# Altium schematic sheet Microcontroller and Power Management.SchDoc
size A4; SheetNumber: 1; SheetTotal: 4
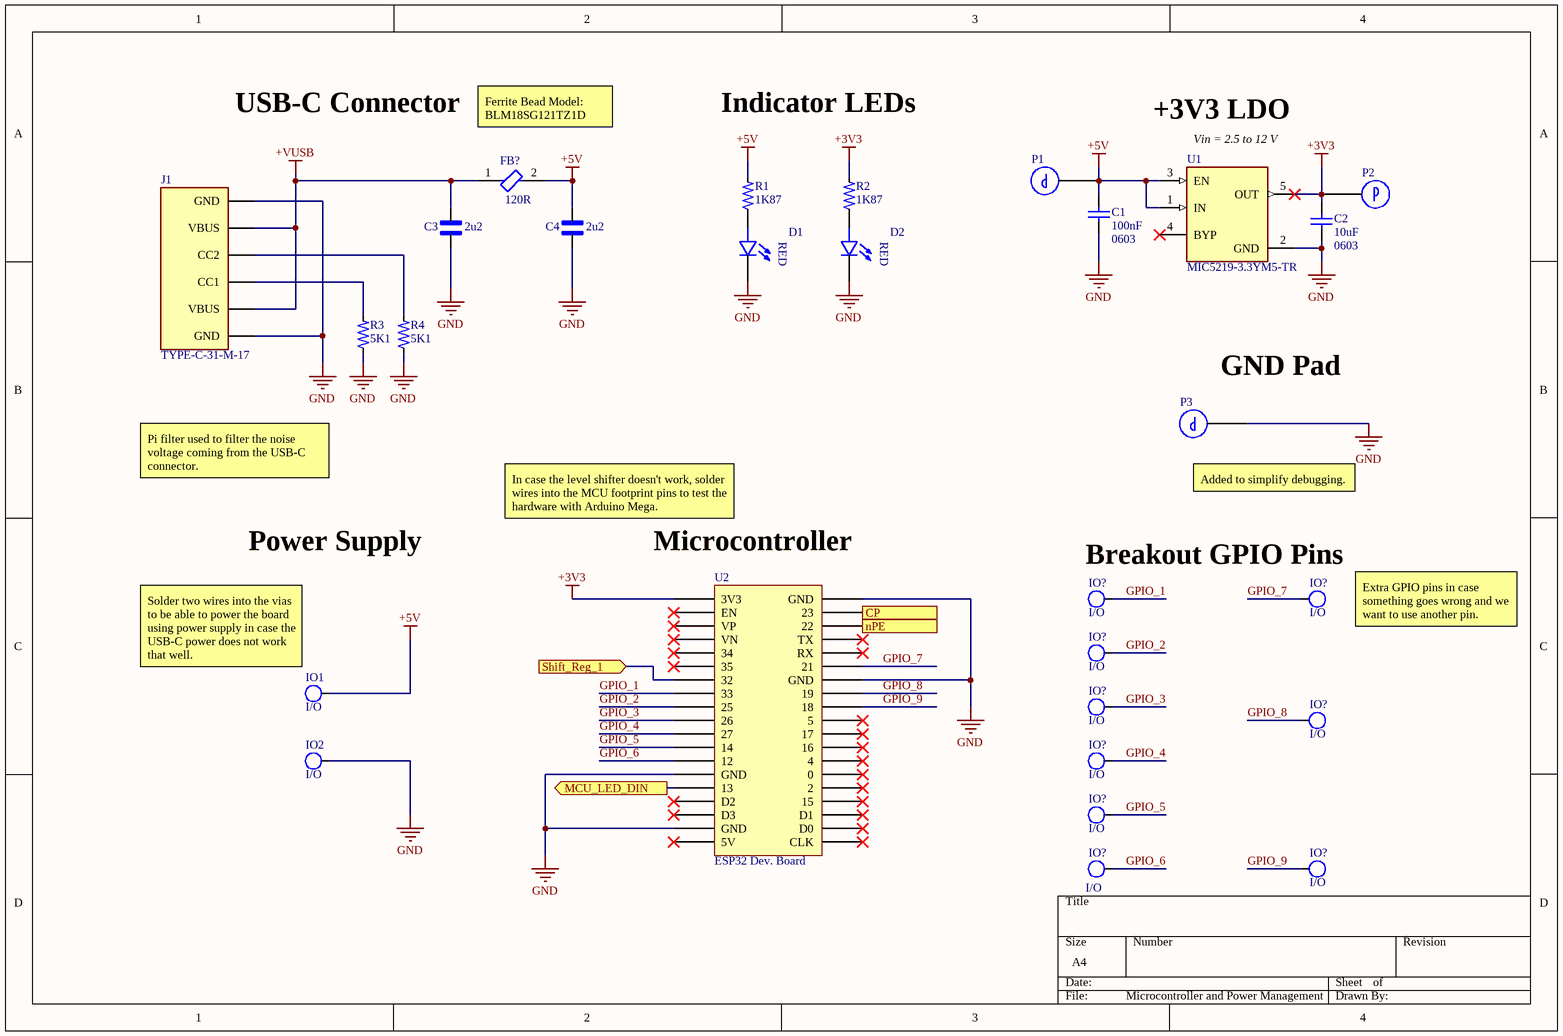
[diagram p0: Microcontroller and Power Management.SchDoc]

## Parts
(Parts that share a designator on the sheet are numbered #1, #2 ... from top to bottom, then left to right.)
C1  100nF  value 0603  [CAP 0805]
C2  10uF  value 0603  [CAP 0805]
C3  2u2  [CAP 0805]
C4  2u2  [CAP 0805]
D1  LED 0805  [LED_0805]  (value not drawn)
D2  LED 0805  [LED_0805]  (value not drawn)
FB?  120R  [FP-BLM21-0_2-t0_85-e0_5-IPC_A]
IO1  I/O  [I/O]
IO2  I/O  [I/O]
IO?#1  I/O
IO?#2  I/O
IO?#3  I/O
IO?#4  I/O
IO?#5  I/O
IO?#6  I/O
IO?#7  I/O
IO?#8  I/O
IO?#9  I/O
J1  TYPE-C-31-M-17  [TYPEC31M17]
P1  Probe_5019  [Testpoint]  (value not drawn)
P2  Probe_5019  [Testpoint]  (value not drawn)
P3  Probe_5019  [Testpoint]  (value not drawn)
R1  1K87  [res 0805]
R2  1K87  [res 0805]
R3  5K1  [res 0805]
R4  5K1  [res 0805]
U1  MIC5219-3.3YM5-TR  [FP-SOT23-5LD-PL-1-IPC_C]
U2  ESP32 Dev. Board

## Ports
CP (out, see Shift Registers[1A]), MCU_LED_DIN (out, see WS2818B[1B]), nPE (out, see Shift Registers[1B]), Shift_Reg_1 (in, see Shift Registers[3B])

## Nets
+3V3: C2.2 P2.1 R2.2 U1.5(OUT) U2.1(3V3)
+5V: C1.2 C4.2 FB?.2 IO1.1 P1.1 R1.2 U1.1(IN) U1.3(EN)
+VUSB: C3.2 FB?.1 J1.2(VBUS) J1.5(VBUS)
GND: C1.1 C2.1 C3.1 C4.1 D1.1(C) D2.1(C) IO2.1 J1.1(GND) J1.6(GND) P3.1 R3.1 R4.1 U1.2(GND) U2.14(GND) U2.18(GND) U2.32(GND) U2.38(GND)
CP: U2.37(23) ; port CP
GPIO_1: IO?#1.1 U2.8(33)
GPIO_2: IO?#3.1 U2.9(25)
GPIO_3: IO?#4.1 U2.10(26)
GPIO_4: IO?#6.1 U2.11(27)
GPIO_5: IO?#7.1 U2.12(14)
GPIO_6: IO?#8.1 U2.13(12)
GPIO_7: IO?#2.1 U2.33(21)
GPIO_8: IO?#5.1 U2.31(19)
GPIO_9: IO?#9.1 U2.30(18)
MCU_LED_DIN: U2.15(13) ; port MCU_LED_DIN
nPE: U2.36(22) ; port nPE
Shift_Reg_1: U2.7(32) ; port Shift_Reg_1
NetD1_2: D1.2(A) R1.1
NetD2_2: D2.2(A) R2.1
NetJ1_3: J1.3(CC1) R3.2
NetJ1_4: J1.4(CC2) R4.2

Not connected (* = marked no-connect by the designer): U1 4(BYP)*; U2 2(EN)* 3(VP)* 4(VN)* 5(34)* 6(35)* 16(D2)* 17(D3)* 19(5V)* 20(CLK)* 21(D0)* 22(D1)* 23(15)* 24(2)* 25(0)* 26(4)* 27(16)* 28(17)* 29(5)* 34(RX)* 35(TX)*

## Notes on the sheet
- USB-C Connector
- Indicator LEDs
- Ferrite Bead Model: BLM18SG121TZ1D
- +3V3 LDO
- (near U1) Vin = 2.5 to 12 V
- (near P3) GND Pad
- Pi filter used to filter the noise voltage coming from the USB-C connector.
- In case the level shifter doesn't work, solder wires into the MCU footprint pins to test the hardware with Arduino Mega.
- (near P3) Added to simplify debugging.
- Power Supply
- (near U2) Microcontroller
- (near IO?#1) Breakout GPIO Pins
- (near IO?#2) Extra GPIO pins in case something goes wrong and we want to use another pin.
- (near IO1) Solder two wires into the vias to be able to power the board using power supply in case the USB-C power does not work that well.
- (in symbol LED 0805) RED

## Library data of the parts
C1 C2 = Cap: Capacitor; Published: 8-Jun-2000; LatestRevisionDate: 17-Jul-2002; LatestRevisionNote: Re-released for DXP Platform.; PackageReference: RAD-0.3; Publisher: Altium Limited; PackageDescription: Radial Cap, Thru-Hole; 2 Leads; 0.3 in Pin Spacing
C3 C4 = CAP 0805: SnapEDA_Link: https://www.snapeda.com/parts/C2012X8R1H104K125AA/TDK/view-part/?ref=snap; Check_prices: https://www.snapeda.com/parts/C2012X8R1H104K125AA/TDK/view-part/?ref=eda; Value: *
D1 D2 = LED 0805: Red LED Indication - Discrete 1.7V 0805 (2012 Metric); MP: 7012X1; Package: None; Availability: Unavailable; Value: *; Price: None
FB? = CMP-0686-00716-3: FERRITE BEAD 120 OHM 0603 1LN; Number of Lines: 1; DC Resistance-Max: 100mR; Material: Steel; Max DC Current: 200mA; Shielding: Unshielded; Test Frequency: 100MHz; Current Rating: 800mA; Max Current Rating: 1A; Resistance: 150mR; Tolerance: 25%; Width: 1.25mm; Number of Circuits: 1; Military Standard: Not; Height: 0.85mm; Series: BLM21A; Min Operating Temperature: -55°C; DC Resistance (DCR): 100mR; Termination: SMD/SMT; Impedance: 120R; Core Material: Ferrite; REACH SVHC: No SVHC; Radiation Hardening: No; Max Operating Temperature: 125°C; Number of Pins: 2; Case/Package: 0805; Case Code (Imperial): 0805; Frequency: 100MHz; Depth: 1.25mm; Length: 2mm; DC Current: 200mA; Lead Free: Lead Free; Case Code (Metric): 2012; Package Quantity: 1; Packaging: Tape and Reel
J1 = TYPE-C-31-M-17: TYPE-C-31-M-17 HROPARTS; MF: HRO Electronics Co., Ltd.; SnapEDA_Link: https://www.snapeda.com/parts/TYPE-C-31-M-17/HRO+Electronics+Co.%252C+Ltd./view-part/?ref=snap; Package: Package; Value: *; MP: TYPE-C-31-M-17; Check_prices: https://www.snapeda.com/parts/TYPE-C-31-M-17/HRO+Electronics+Co.%252C+Ltd./view-part/?ref=eda
P1-P3 = Probe_5019: Phosphor Bronze Contact Miniature Silver Plated Surface Mount Test Points; Manufacturer: Keystone Electronics; Manufacturer Part Number: 5019; Supplier 1: Newark; RoHS: Yes; Category: Connectors; Stock 1: 148000; Pricing 1: 1=0.12300, 1000=0.12300, 2000=0.11700, 4000=0.11300, 6000=0.11000 (USD); Mount: Surface Mount,PCB; Number of Pins: 1; Contact Plating: Silver; Contact Material: Bronze; Material: Bronze; Plating: Silver; Body Material: Bronze; Packaging: Tape and Reel; Package Quantity: 1; Termination: SMD/SMT; Series: 5019; Height: 0.09inch; RoHS Compliant: Yes; Lead Free: Lead Free; Reach SVHC Compliant: Yes; ComponentLink1URL: https://datasheet.ciiva.com/16318/m60-2p61-16318395.pdf?src-supplier=Future+Electronics; ComponentLink1Description: https://datasheet.ciiva.com/16318/m60-2p61-16318395.pdf?src-supplier=Future+Electronics; ComponentLink2URL: https://datasheet.ciiva.com/16885/70182998-16885945.pdf?src-supplier=Allied+Electronics; ComponentLink2Description: https://datasheet.ciiva.com/16885/70182998-16885945.pdf?src-supplier=Allied+Electronics; ComponentLink3URL: https://datasheet.ciiva.com/14848/m60-2p61-14848437.pdf?src-supplier=Digi-Key; ComponentLink3Description: https://datasheet.ciiva.com/14848/m60-2p61-14848437.pdf?src-supplier=Digi-Key; ComponentLink4URL: https://datasheet.ciiva.com/14848/m60-2p61-14848438.pdf?src-supplier=Digi-Key; ComponentLink4Description: https://datasheet.ciiva.com/14848/m60-2p61-14848438.pdf?src-supplier=Digi-Key; ComponentLink5URL: https://datasheet.ciiva.com/14848/m60-2p61-14848439.pdf?src-supplier=Digi-Key; ComponentLink5Description: https://datasheet.ciiva.com/14848/m60-2p61-14848439.pdf?src-supplier=Digi-Key; Supplier Part Number 1: 06W4636
R1-R4 = Resistor 0805: MP: 2-2176053-2; Resistance: .39; Power_Rating: .25 W; MF: TE Connectivity; Tolerance: 1%; Package: 0805; Value: *; SnapEDA_Link: https://www.snapeda.com/parts/2-2176053-2/TE%20Connectivity/view-part/2214511/?ref=snap; Availability: Unavailable; Price: None; EU_RoHS_Compliance: Compliant with Exemptions
U1 = CMP-06324-000027-1: IC REG LINEAR 3.3V 500MA SOT23-5; Dropout Voltage: 350mV; Output Type: Fixed; Number of Regulators: 1; Max Input Voltage: 12V; Min Input Voltage: 2.5V; Min Operating Temperature: -40°C; Nominal Output Voltage: 3.3V; Output Voltage: 3.3V; Packaging: Cut Tape; Mount: Surface Mount; Number of Pins: 5; Case/Package: SOT-23-5; Lead Free: Lead Free; Max Operating Temperature: 125°C; REACH SVHC: No SVHC; Output Current: 500mA
U2 = ESP32 Dev. Board: ESP32-WROOM-32UE Series Evaluation Board 802.11 b/g/n (WiFi, WLAN) Bluetooth Smart Ready 4.x Dual Mode; Manufacturer: Espressif Systems; Manufacturer Part Number: ESP32-DEVKITC-32UE; Supplier: Digikey; Supplier Part Number: 1965-ESP32-DEVKITC-32UE-ND; RoHS: No; Category: RF Semiconductors and Devices; Stock: 498; Pricing: 1=10 (USD); ComponentLink1URL: https://www.espressif.com/sites/default/files/documentation/espressif_products_ordering_information_en.pdf?src-supplier=Digikey; ComponentLink1Description: https://www.espressif.com/sites/default/files/documentation/espressif_products_ordering_information_en.pdf?src-supplier=Digikey; ComponentLink2URL: https://datasheet.octopart.com/ESP32-DEVKITC-32UE-Espressif-Systems-datasheet-165560559.pdf?src-supplier=TME; ComponentLink2Description: https://datasheet.octopart.com/ESP32-DEVKITC-32UE-Espressif-Systems-datasheet-165560559.pdf?src-supplier=TME